# EAGLE design TwoMotorController 2.0 (EAGLE 6.6.0)
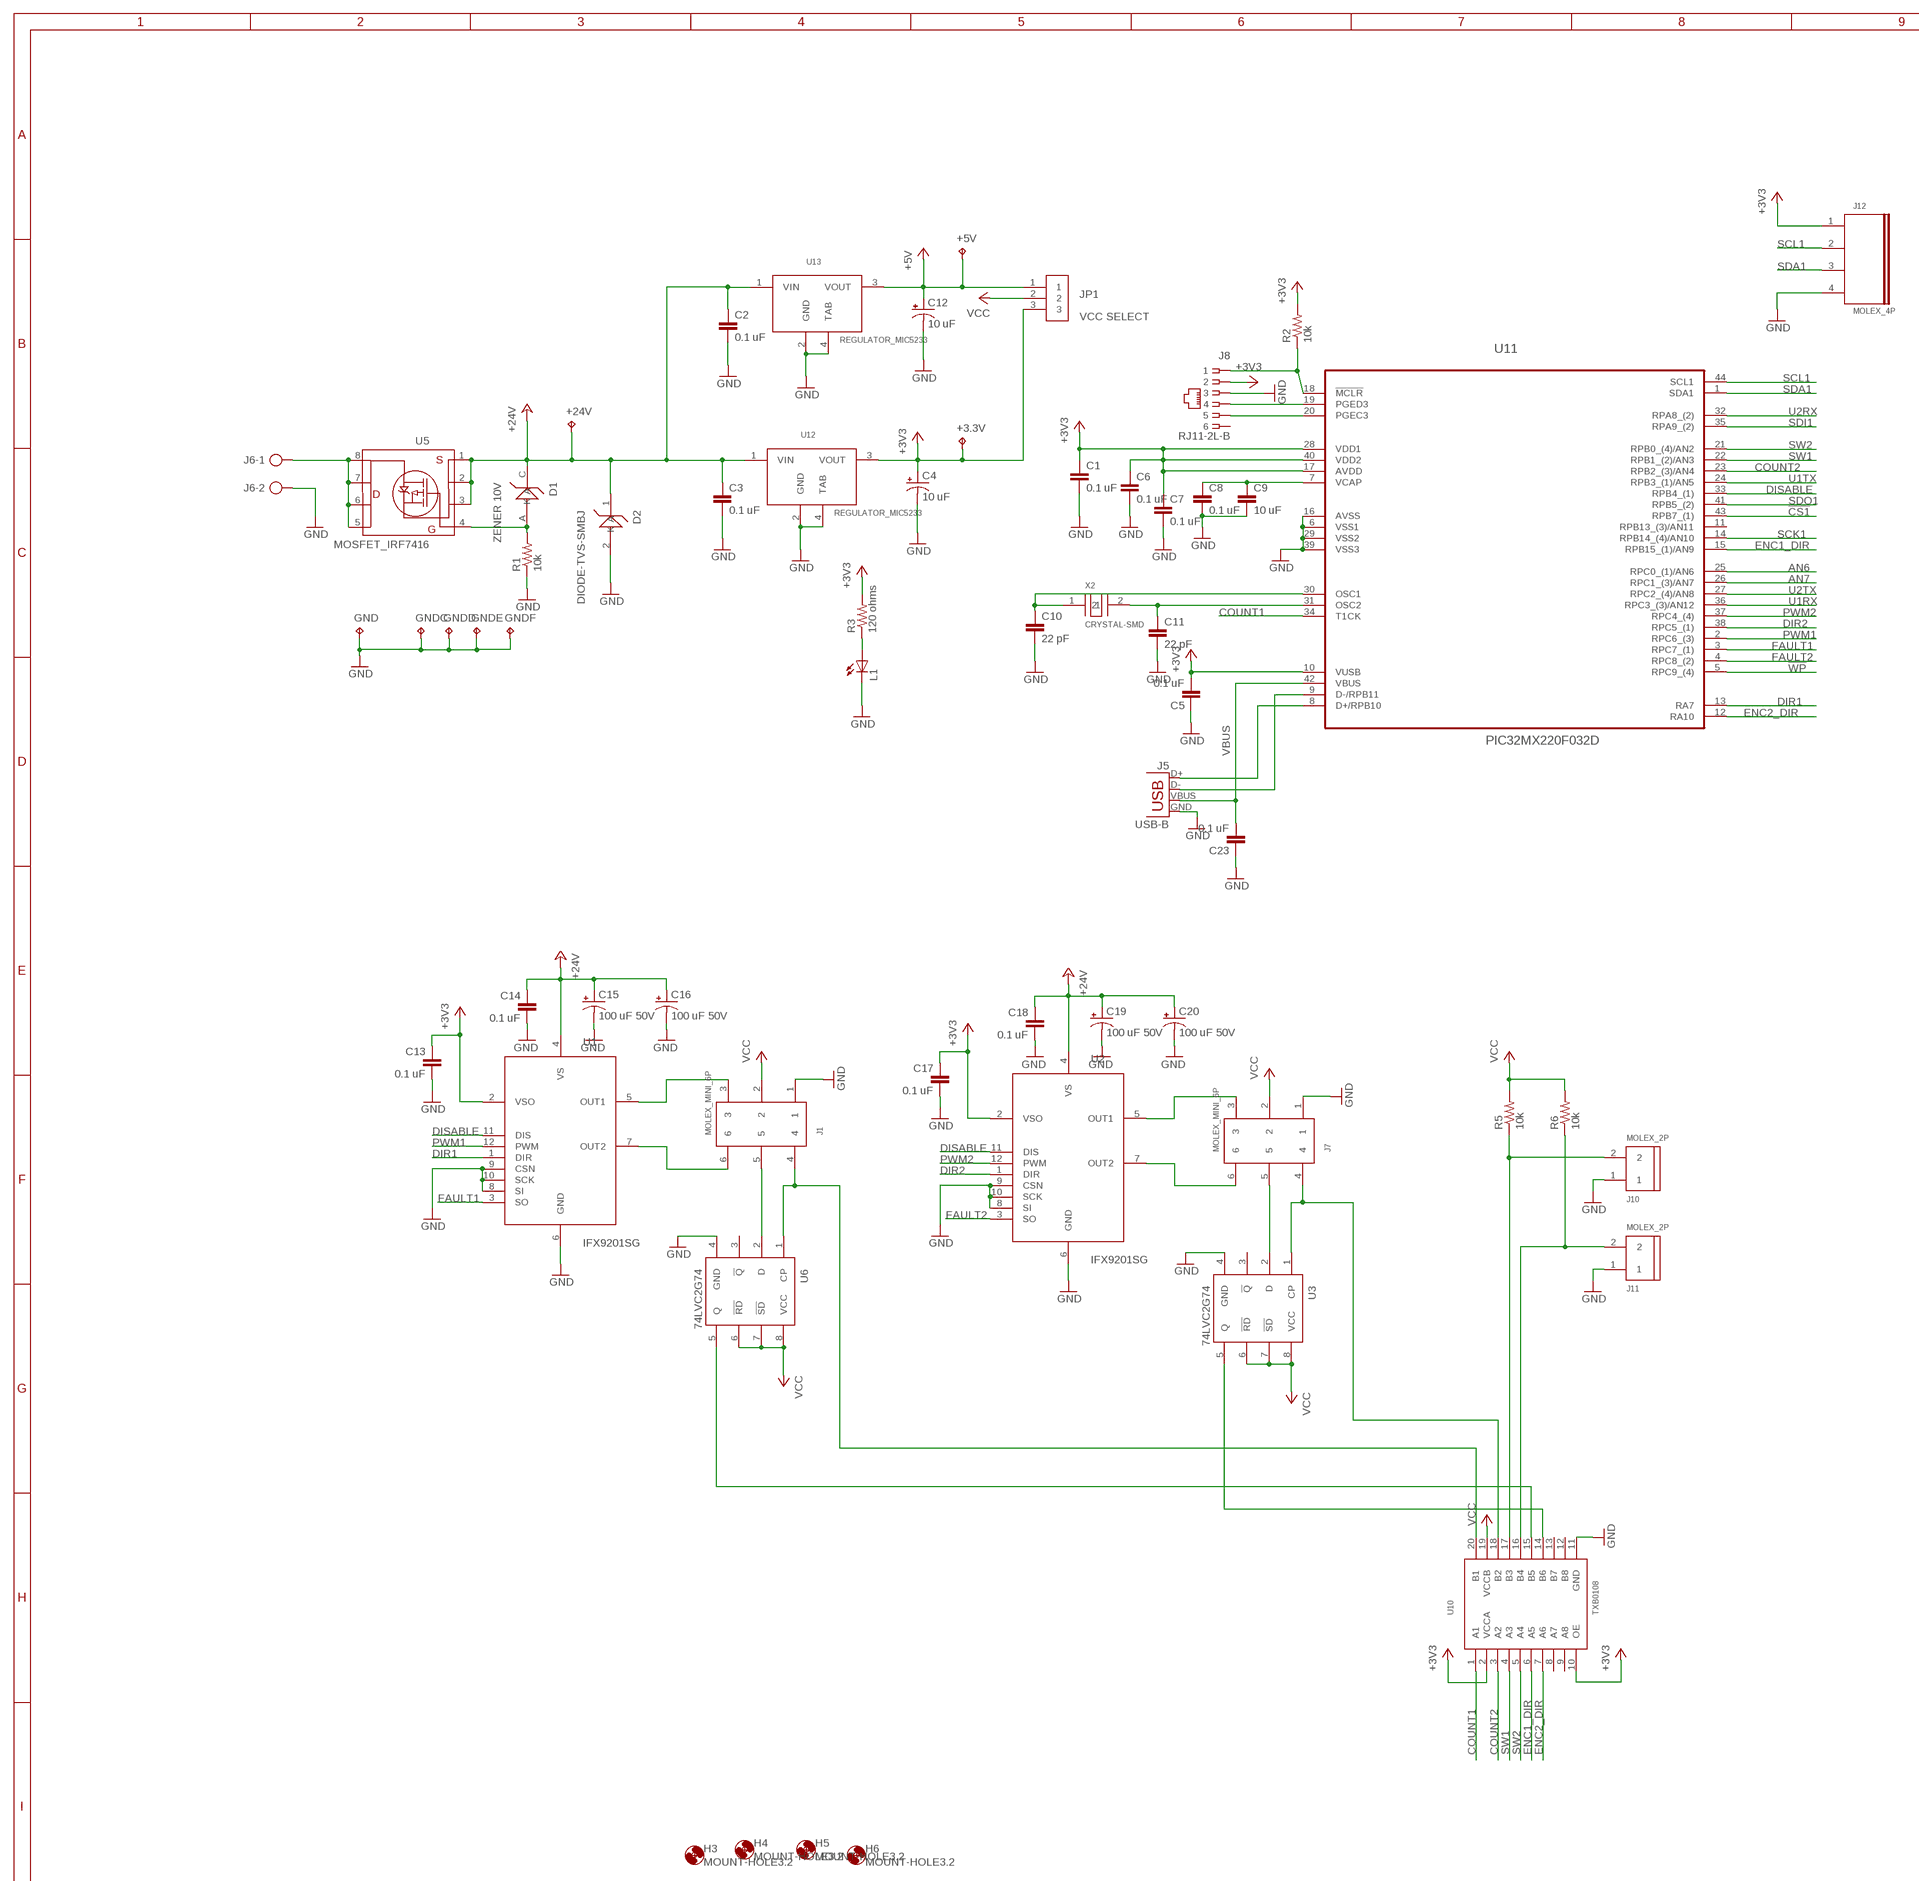
[diagram p0: schematic, sheet 1, part 1 of 2]
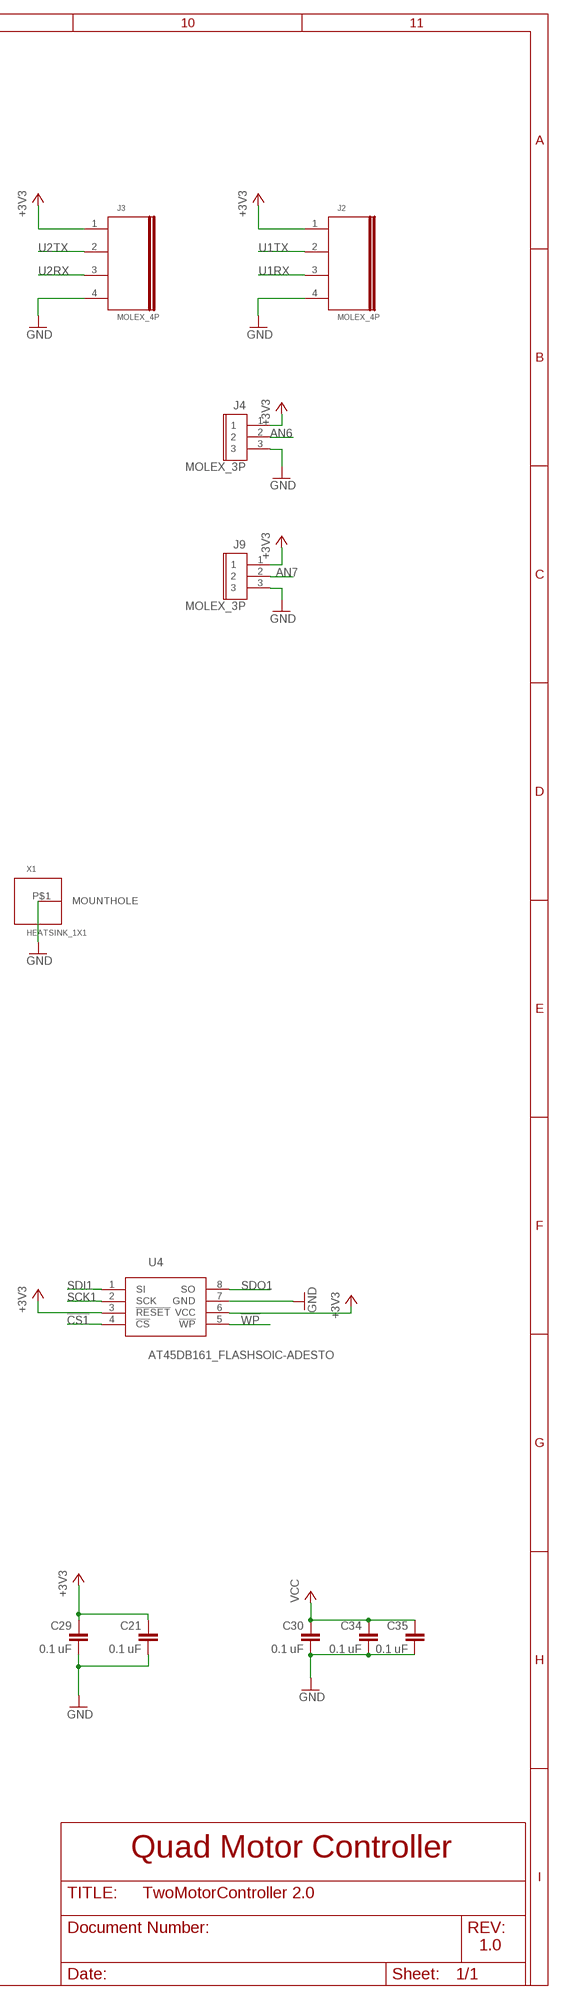
[diagram p1: schematic, sheet 1, part 2 of 2]

## Parts
+3.3V  TP  [TESTPAD]
+5V  TP  [TESTPAD]
+24V  TP  [TESTPAD]
C1  0.1 uF  C0805  [C0805]
C2  0.1 uF  C0805  [C0805]
C3  0.1 uF  C0805  [C0805]
C4  10 uF  POLCAPE2-5  [POLCAP_2MM]
C5  0.1 uF  C2,5-3  [C2.5-3]
C6  0.1 uF  C0805  [C0805]
C7  0.1 uF  C0805  [C0805]
C8  0.1 uF  C0805  [C0805]
C9  10 uF  C0805  [C0805]
C10  22 pF  C0805  [C0805]
C11  22 pF  C0805  [C0805]
C12  10 uF  POLCAPE2-5  [POLCAP_2MM]
C13  0.1 uF  C0805  [C0805]
C14  0.1 uF  C0805  [C0805]
C15  100 uF 50V  POLCAPE3.5-10  [E3,5-10]
C16  100 uF 50V  POLCAPE3.5-10  [E3,5-10]
C17  0.1 uF  C0805  [C0805]
C18  0.1 uF  C0805  [C0805]
C19  100 uF 50V  POLCAPE3.5-10  [E3,5-10]
C20  100 uF 50V  POLCAPE3.5-10  [E3,5-10]
C21  0.1 uF  C0805  [C0805]
C23  0.1 uF  C2,5-3  [C2.5-3]
C29  0.1 uF  C0805  [C0805]
C30  0.1 uF  C0805  [C0805]
C34  0.1 uF  C0805  [C0805]
C35  0.1 uF  C0805  [C0805]
D1  ZENER 10V  DIODE-ZENERDO-214AC  [DO-214AC]
D2  DIODE-TVS-SMBJ  [DIODE-TVS-SMBJ]
GND  TP  [TESTPAD]
GNDC  TP  [TESTPAD]
GNDD  TP  [TESTPAD]
GNDE  TP  [TESTPAD]
GNDF  TP  [TESTPAD]
H3  MOUNT-HOLE3.2  [3,2]
H4  MOUNT-HOLE3.2  [3,2]
H5  MOUNT-HOLE3.2  [3,2]
H6  MOUNT-HOLE3.2  [3,2]
J1  MOLEX_MINI_6P  [MOLEX_MINI_6P]
J2  MOLEX_4P  [MOLEX_4P]
J3  MOLEX_4P  [MOLEX_4P]
J4  MOLEX_3P  [MOLEX_3P]
J5  USB-B  USBPTH  [USB-B-PTH]
J6  TRMBLOCK_5MM_2P  [TRMBLOCK_5MM_2P]
J7  MOLEX_MINI_6P  [MOLEX_MINI_6P]
J8  RJ11-2L-B  [RJ11-NO_SHIELD]
J9  MOLEX_3P  [MOLEX_3P]
J10  MOLEX_2P  [MOLEX_2P]
J11  MOLEX_2P  [MOLEX_2P]
J12  MOLEX_4P  [MOLEX_4P]
JP1  VCC SELECT  JUMPER_3P  [JUMPER_3P]
L1  LED5MM  [LED5MM]
R1  10k  RESISTORR0805  [R0805]
R2  10k  RESISTORR0805  [R0805]
R3  120 ohms  RESISTORR0805  [R0805]
R5  10k  RESISTORR0805  [R0805]
R6  10k  RESISTORR0805  [R0805]
U1  IFX9201SG  [IFX9201SG]
U2  IFX9201SG  [IFX9201SG]
U3  74LVC2G74  [TSSOP8]
U4  AT45DB161_FLASHSOIC-ADESTO  [SOIC-ADESTO]
U5  MOSFET_IRF7416  [SO-8-3.9MM]
U6  74LVC2G74  [TSSOP8]
U10  TXB0108  [TSSOP20]
U11  PIC32MX220F032D  [QFP80P1200X1200X120-44N]
U12  REGULATOR_MIC5233  [REGULATOR_MIC5233]
U13  REGULATOR_MIC5233  [REGULATOR_MIC5233]
X1  HEATSINK_1X1  [HEATSINK_1X1]
X2  CRYSTAL-SMD  [CRYSTAL-SMD]

## Nets
!CS1: U4.4(!CS) U11.43(RPB7_(1))
!WP: U4.5(!WP) U11.5(RPC9_(4))
+3V3: +3.3V.P$1(TP) C1.1 C4.+ C5.2 C6.1 C7.1 C13.1 C17.1 C21.1 C29.1 J2.1 J3.1 J4.1 J8.2 J9.1 J12.1 JP1.3 R2.2 R3.2 U1.2(VSO) U2.2(VSO) U4.3(!RESET) U4.6(VCC) U10.2(VCCA) U10.10(OE) U11.10(VUSB) U11.17(AVDD) U11.28(VDD1) U11.40(VDD2) U12.3(VOUT)
+5V: +5V.P$1(TP) C12.+ JP1.1 U13.3(VOUT)
+24V: +24V.P$1(TP) C2.1 C3.1 C14.1 C15.+ C16.+ C18.1 C19.+ C20.+ D1.C(K) D2.1(K) U1.4(VS) U2.4(VS) U5.1 U5.2 U5.3 U12.1(VIN) U13.1(VIN)
AN6: J4.2 U11.25(RPC0_(1)/AN6)
AN7: J9.2 U11.26(RPC1_(3)/AN7)
COUNT1: U10.1(A1) U11.34(T1CK)
COUNT2: U10.3(A2) U11.23(RPB2_(3)/AN4)
DIR1: U1.1(DIR) U11.13(RA7)
DIR2: U2.1(DIR) U11.38(RPC5_(1))
DISABLE: U1.11(DIS) U2.11(DIS) U11.33(RPB4_(1))
ENC1_DIR: U10.6(A5) U11.15(RPB15_(1)/AN9)
ENC2_DIR: U10.7(A6) U11.12(RA10)
FAULT1: U1.3(SO) U11.3(RPC7_(1))
FAULT2: U2.3(SO) U11.4(RPC8_(2))
GND: C1.2 C2.2 C3.2 C4.- C5.1 C6.2 C7.2 C8.2 C9.2 C10.2 C11.2 C12.- C13.2 C14.2 C15.- C16.- C17.2 C18.2 C19.- C20.- C21.2 C23.1 C29.2 C30.2 C34.2 C35.2 D2.2(A) GND.P$1(TP) GNDC.P$1(TP) GNDD.P$1(TP) GNDE.P$1(TP) GNDF.P$1(TP) J1.1 J2.4 J3.4 J4.3 J5.GND J6.2 J7.1 J8.3 J9.3 J10.1 J11.1 J12.4 L1.K(C) R1.1 U1.6(GND) U1.8(SI) U1.9(CSN) U1.10(SCK) U2.6(GND) U2.8(SI) U2.9(CSN) U2.10(SCK) U3.4(GND) U4.7(GND) U6.4(GND) U10.11(GND) U11.6(VSS1) U11.16(AVSS) U11.29(VSS2) U11.39(VSS3) U12.2(GND) U12.4(TAB) U13.2(GND) U13.4(TAB) X1.P$1(MOUNTHOLE)
N$1: J7.3 U2.5(OUT1)
N$2: C11.1 U11.31(OSC2) X2.2
N$3: C10.1 U11.30(OSC1) X2.1
N$4: J1.3 U1.5(OUT1)
N$5: J6.1 U5.5 U5.6 U5.7 U5.8
N$6: D1.A R1.2 U5.4
N$7: J1.6 U1.7(OUT2)
N$8: J1.5 U6.2(D)
N$9: U6.5(Q) U10.15(B5)
N$10: J8.1 R2.1 U11.18(!MCLR)
N$11: J8.4 U11.19(PGED3)
N$12: J8.5 U11.20(PGEC3)
N$13: C8.1 C9.1 U11.7(VCAP)
N$14: J7.6 U2.7(OUT2)
N$15: J7.5 U3.2(D)
N$16: U3.5(Q) U10.14(B6)
N$17: J10.2 R5.1 U10.17(B3)
N$18: J11.2 R6.1 U10.16(B4)
N$22: J5.D+ U11.8(D+/RPB10)
N$23: J5.D- U11.9(D-/RPB11)
N$29: L1.A R3.1
N$30: J1.4 U6.1(CP) U10.20(B1)
N$31: J7.4 U3.1(CP) U10.18(B2)
PWM1: U1.12(PWM) U11.2(RPC6_(3))
PWM2: U2.12(PWM) U11.37(RPC4_(4))
SCK1: U4.2(SCK) U11.14(RPB14_(4)/AN10)
SCL1: J12.2 U11.44(SCL1)
SDA1: J12.3 U11.1(SDA1)
SDI1: U4.1(SI) U11.35(RPA9_(2))
SDO1: U4.8(SO) U11.41(RPB5_(2))
SW1: U10.4(A3) U11.22(RPB1_(2)/AN3)
SW2: U10.5(A4) U11.21(RPB0_(4)/AN2)
U1RX: J2.3 U11.36(RPC3_(3)/AN12)
U1TX: J2.2 U11.24(RPB3_(1)/AN5)
U2RX: J3.3 U11.32(RPA8_(2))
U2TX: J3.2 U11.27(RPC2_(4)/AN8)
VBUS: C23.2 J5.VBUS U11.42(VBUS)
VCC: C30.1 C34.1 C35.1 J1.2 J7.2 JP1.2 R5.2 R6.2 U3.6(!RD) U3.7(!SD) U3.8(VCC) U6.6(!RD) U6.7(!SD) U6.8(VCC) U10.19(VCCB)
Unconnected: J8.6 U3.3(!Q) U6.3(!Q) U10.8(A7) U10.9(A8) U10.12(B8) U10.13(B7) U11.11(RPB13_(3)/AN11)

## Notes on the sheet
- Quad Motor Controller
- 1.0

## Library data of the parts
+3.3V +5V +24V GND GNDC GNDD GNDE GNDF = JimLib:TP: Test pad
C1-C3 C6-C11 C13 C14 C17 C18 C21 C29 C30 C34 C35 = JimLib:C0805
C4 C12 C15 C16 C19 C20 = JimLib:POLCAP: POLARIZED CAPACITOR, American symbol
C5 C23 = JimLib:C: CAPACITOR naming: grid - package width
D1 = JimLib:DIODE-ZENER
D2 = JimLib:DIODE-TVS-SMBJ
H3-H6 = holes:MOUNT-HOLE: MOUNTING HOLE with drill center marker
J1 J7 = JimLib:MOLEX_MINI_6P
J2 J3 J12 = JimLib:MOLEX_4P: .100" (2.54mm) Center Header - 3 Pin
J4 J9 = JimLib:MOLEX_3P
J5 = SparkFun-Connectors:USB: USB Connectors USB-B-PTH is fully proven SKU : PRT-00139/CONN-08278 USB-miniB is fully proven SKU : PRT-00587 USB-A-PCB is untested. USB-A-H is throughly reviewed, but untested. Spark Fun Electronics SKU : PRT-00437 USB-B-SMT is throughly reviewed, but untested. Needs silkscreen touching up. USB-A-S has not been used/tested USB-MB-H has not been used/tested USB-MICROB has been used. CONN-09505; PROD_ID: CONN-08278
J6 = JimLib:TRMBLOCK_5MM_2P: CONNECTOR
J8 = JimLib:RJ11: CORCOM Modular RJ Jacks No Shield Source: www.tycoelectronics.com .. ENG_DS_1654001_1099_RJ_L_0507.pdf; MF: TYCO ELECTRONICS; MPN: RJ11-2L-B; OC_FARNELL: unknown; OC_NEWARK: 83F4463
J10 J11 = JimLib:MOLEX_2P
JP1 = JimLib:JUMPER_3P
L1 = led:LED: LED OSRAM: - CHIPLED LG R971, LG N971, LY N971, LG Q971, LY Q971, LO R971, LY R971 LH N974, LH R974 LS Q976, LO Q976, LY Q976 LO Q996 - Hyper CHIPLED LW Q18S LB Q993, LB Q99A, LB R99A - SideLED LS A670, LO A670, LY A670, LG A670, LP A670 LB A673, LV A673, LT A673, LW A673 LH A674 LY A675 LS A676, LA A676, LO A676, LY A676, LW A676 LS A679, LY A679, LG A679 - Hyper Micro SIDELED® LS Y876, LA Y876, LO Y876, LY Y876 LT Y87S - SmartLED LW L88C, LW L88S LB L89C, LB L89S, LG L890 LS L89K, LO L89K, LY L89K LS L896, LA L896, LO L896, LY L896 - TOPLED LS T670, LO T670, LY T670, LG T670, LP T670 LSG T670, LSP T670, LSY T670, LOP T670, LYG T670 LG T671, LOG T671, LSG T671 LB T673, LV T673, LT T673, LW T673 LH T674 LS T676, LA T676, LO T676, LY T676, LB T676, LH T676, LSB T676, LW T676 LB T67C, LV T67C, LT T67C, LS T67K, LO T67K, LY T67K, LW E67C LS E67B, LA E67B, LO E67B, LY E67B, LB E67C, LV E67C, LT E67C LW T67C LS T679, LY T679, LG T679 LS T770, LO T770, LY T770, LG T770, LP T770 LB T773, LV T773, LT T773, LW T773 LH T774 LS E675, LA E675, LY E675, LS T675 LS T776, LA T776, LO T776, LY T776, LB T776 LHGB T686 LT T68C, LB T68C - Hyper Mini TOPLED® LB M676 - Mini TOPLED Santana® LG M470 LS M47K, LO M47K, LY M47K Source: http://www.osram.convergy.de LUXEON: - LUMILED® LXK2-PW12-R00, LXK2-PW12-S00, LXK2-PW14-U00, LXK2-PW14-V00 LXK2-PM12-R00, LXK2-PM12-S00, LXK2-PM14-U00 LXK2-PE12-Q00, LXK2-PE12-R00, LXK2-PE12-S00, LXK2-PE14-T00, LXK2-PE14-U00 LXK2-PB12-K00, LXK2-PB12-L00, LXK2-PB12-M00, LXK2-PB14-N00, LXK2-PB14-P00, LXK2-PB14-Q00 LXK2-PR12-L00, LXK2-PR12-M00, LXK2-PR14-Q00, LXK2-PR14-R00 LXK2-PD12-Q00, LXK2-PD12-R00, LXK2-PD12-S00 LXK2-PH12-R00, LXK2-PH12-S00 LXK2-PL12-P00, LXK2-PL12-Q00, LXK2-PL12-R00 Source: www.luxeon.com KINGBRIGHT: KA-3528ASYC Source: www.kingbright.com
R1-R3 R5 R6 = JimLib:RESISTOR: RESISTOR, American symbol
U1 U2 = JimLib:IFX9201SG: Infineon 6A H Bridge
U3 U6 = JimLib:74LVC2G74
U4 = JimLib:AT45DB161_FLASH
U5 = JimLib:MOSFET_IRF7416: MOSFET P-CH 30V 10A 8-SOIC IRF7416TRPBFCT-ND
U10 = JimLib:TXB0108
U11 = JimLib:PIC32MX220F032D: PIC32MX220F032D-I/PT 44-TQFP; MPN: PIC18F4550-I/PT; OC_FARNELL: 9321365; OC_NEWARK: 08J9633; PACKAGE: QFP-44; SUPPLIER: Microchip
U12 U13 = JimLib:REGULATOR_MIC5233
X1 = JimLib:HEATSINK_1X1: Ohmite #E3A-T220-25E 1" x 1" heatsink with #8-32 mounting hole DigiKey #E3A-T220-25E-ND
X2 = JimLib:CRYSTAL-SMD

## Board
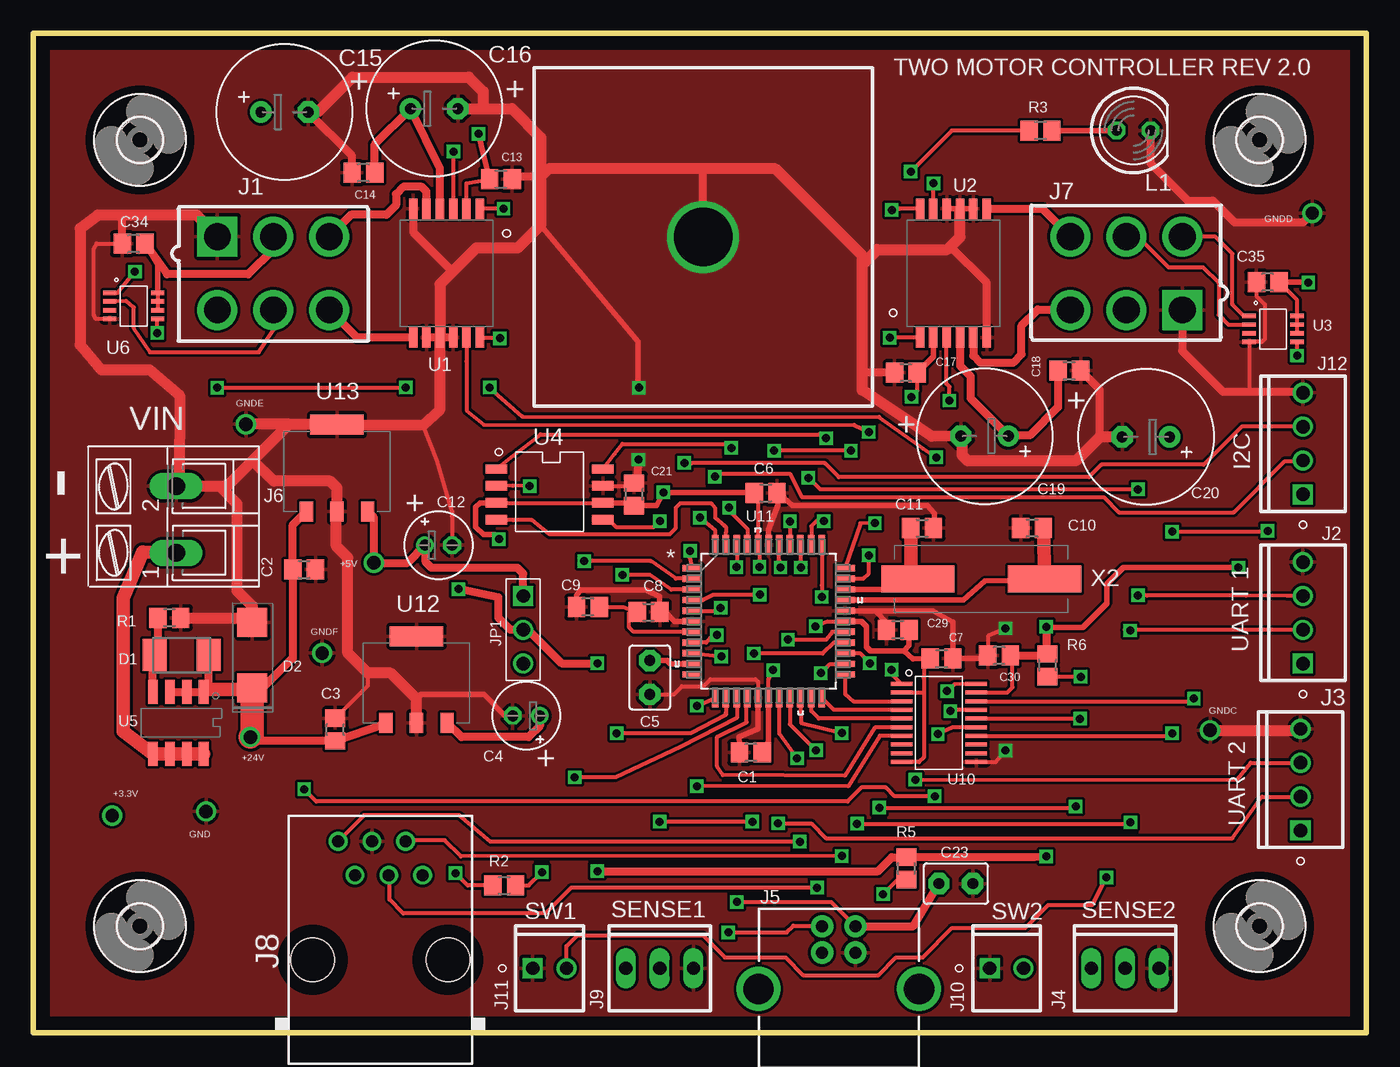
[diagram p2: board, top side]
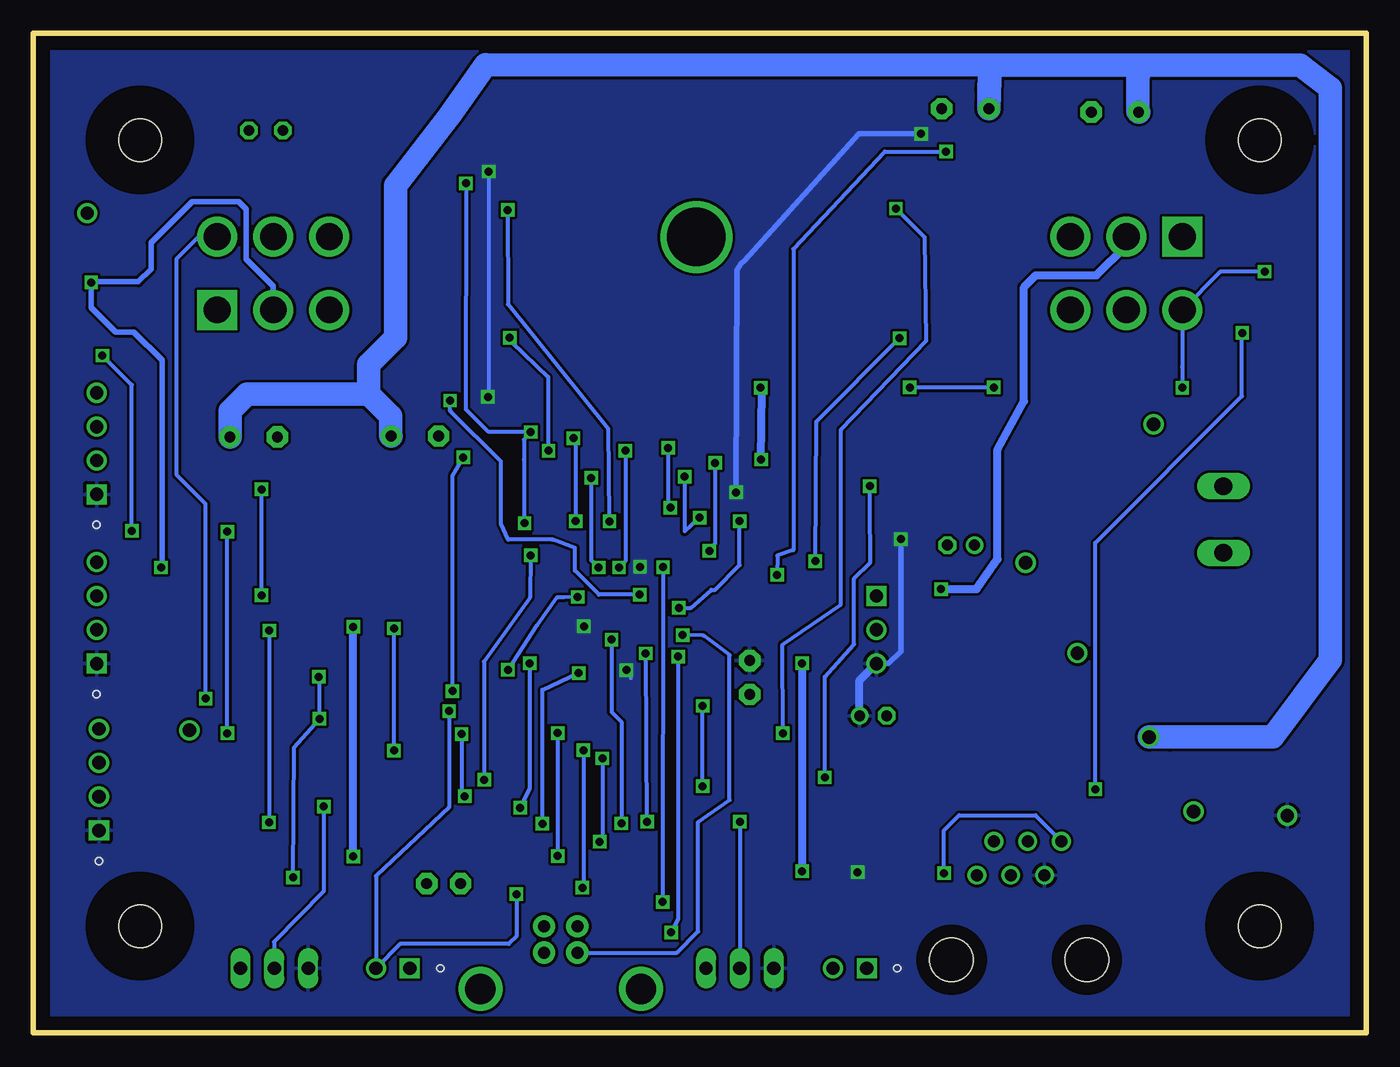
[diagram p3: board, bottom side, seen from below]

Size 100 x 75.03 mm. Coordinates in mm from the lower left corner, seen from the top.
Outline: 0,0.03 0,75.03 100,75.03 100,0.03 0,0.03
Copper layers (1*16): Top 0.035mm / dielectric 1.5mm / Bottom 0.035mm
Design rules "default *": minimum track width 10mil, minimum drill 22mil, track to track 8mil, track to pad 8mil, pad to pad 8mil, via to via 8mil, smd to smd 8mil, copper to edge 40mil, drill to drill 8mil, minimum pad ring 10mil, minimum via ring 8mil, stop-mask expansion 4mil, vias tented up to drill 0mil, thermal gap 10mil

### Footprints (pad centres in the part's own frame; a part is rotated, then mirrored left to right if it is on the bottom)
TESTPAD = drill 1: P$1 0,0
C0805 = smd 1.3 x 1.5: 1 -0.85,0; 2 0.85,0
POLCAP_2MM = drill 0.813 pad 1.27: + -1.016,0 | drill 0.813 pad 1.27 octagon: - 1.016,0
C2.5-3 = drill 0.813 pad 1.6 octagon: 1 -1.27,0; 2 1.27,0
E3,5-10 = drill 0.813 pad 1.6: + -1.778,0 | drill 0.813 pad 1.6 octagon: - 1.778,0
DO-214AC = smd 1.8 x 2.4: A 2.025,0; C -2.025,0
DIODE-TVS-SMBJ = smd 2.16 x 2.26: 1 -2.45,0; 2 2.45,0
3,2 = hole 3.2: 0,0
MOLEX_MINI_6P = drill 2 square: 1 -4.2,2.75 | drill 2: 2 0,2.75; 3 4.2,2.75; 4 -4.2,-2.75; 5 0,-2.75; 6 4.2,-2.75
MOLEX_4P = drill 1 square: 1 -3.81,0 | drill 1: 2 -1.27,0; 3 1.27,0; 4 3.81,0
MOLEX_3P = drill 1 long: 1 -2.54,0; 2 0,0; 3 2.54,0
USB-B-PTH = drill 0.914 pad 1.676: D+ 0,1.25; D- 1.981,1.25; GND 0,-1.25; VBUS 1.981,-1.25 | drill 2.286: S1 -2.718,-6.02; S2 -2.718,6.02
TRMBLOCK_5MM_2P = drill 1.321 long: 1 -1.854,-1.27; 2 3.15,-1.27
RJ11-NO_SHIELD = drill 0.9 pad 1.4: 1 -3.175,8.89; 2 -1.905,6.35; 3 -0.635,8.89; 4 0.635,6.35; 5 1.905,8.89; 6 3.175,6.35 | hole 3.251: -5.08,0; 5.08,0
MOLEX_2P = drill 1 square: 1 -1.27,0 | drill 1: 2 1.27,0
JUMPER_3P = drill 1 square: 1 -2.54,0 | drill 1: 2 0,0; 3 2.54,0
LED5MM = drill 0.813 octagon: A -1.27,0; K 1.27,0
R0805 = smd 1.3 x 1.5: 1 -0.85,0; 2 0.85,0
IFX9201SG = smd 0.635 x 1.524: 1 -2.5,-4.826; 2 -1.5,-4.826; 3 -0.5,-4.826; 4 0.5,-4.826; 5 1.5,-4.826; 6 2.5,-4.826; 7 2.5,4.826; 8 1.5,4.826; 9 0.5,4.826; 10 -0.5,4.826; 11 -1.5,4.826; 12 -2.5,4.826
TSSOP8 = smd 0.33 x 1: 1 -0.975,-1.8; 2 -0.325,-1.8; 3 0.325,-1.8; 4 0.975,-1.8; 5 0.975,1.8; 6 0.325,1.8; 7 -0.325,1.8; 8 -0.975,1.8
SOIC-ADESTO = smd 0.7 x 1.6: 1 -1.27,-4; 2 0,-4; 3 1.27,-4; 4 2.54,-4; 5 2.54,4; 6 1.27,4; 7 0,4; 8 -1.27,4
SO-8-3.9MM = smd 0.72 x 1.8: 1 -1.905,-2.34; 2 -0.635,-2.34; 3 0.635,-2.34; 4 1.905,-2.34; 5 1.905,2.34; 6 0.635,2.34; 7 -0.635,2.34; 8 -1.905,2.34
TSSOP20 = smd 0.3 x 1.6: 1 -2.925,-2.8; 2 -2.275,-2.8; 3 -1.625,-2.8; 4 -0.975,-2.8; 5 -0.325,-2.8; 6 0.325,-2.8; 7 0.975,-2.8; 8 1.625,-2.8; 9 2.275,-2.8; 10 2.925,-2.8; 11 2.925,2.8; 12 2.275,2.8; 13 1.625,2.8; 14 0.975,2.8; 15 0.325,2.8; 16 -0.325,2.8; 17 -0.975,2.8; 18 -1.625,2.8; 19 -2.275,2.8; 20 -2.925,2.8
QFP80P1200X1200X120-44N = smd 1.473 x 0.483: 1 -5.74,3.988; 2 -5.74,3.2; 3 -5.74,2.388; 4 -5.74,1.6; 5 -5.74,0.787; 6 -5.74,0; 7 -5.74,-0.787; 8 -5.74,-1.6; 9 -5.74,-2.388; 10 -5.74,-3.2; 11 -5.74,-3.988; 23 5.74,-3.988; 24 5.74,-3.2; 25 5.74,-2.388; 26 5.74,-1.6; 27 5.74,-0.787; 28 5.74,0; 29 5.74,0.787; 30 5.74,1.6; 31 5.74,2.388; 32 5.74,3.2; 33 5.74,3.988 | smd 0.483 x 1.473: 12 -3.988,-5.74; 13 -3.2,-5.74; 14 -2.388,-5.74; 15 -1.6,-5.74; 16 -0.787,-5.74; 17 0,-5.74; 18 0.787,-5.74; 19 1.6,-5.74; 20 2.388,-5.74; 21 3.2,-5.74; 22 3.988,-5.74; 34 3.988,5.74; 35 3.2,5.74; 36 2.388,5.74; 37 1.6,5.74; 38 0.787,5.74; 39 0,5.74; 40 -0.787,5.74; 41 -1.6,5.74; 42 -2.388,5.74; 43 -3.2,5.74; 44 -3.988,5.74
REGULATOR_MIC5233 = smd 1 x 1.5: 1 -2.3,0; 2 0,0; 3 2.3,0 | smd 4 x 1.5: 4 0,6.5
HEATSINK_1X1 = drill 4.394: P$1 0,0
CRYSTAL-SMD = smd 5.5 x 2: 1 -4.75,0; 2 4.75,0

### Placement (x,y rotation side)
+3.3V  5.92,16.33 0 top
+5V  25.55,35.3 0 top
+24V  16.28,22.22 0 top
C1  53.83,21.07 180 top
C2  20.32,34.8 0 top
C3  22.65,22.78 90 top
C4  36.99,23.82 180 top
C5  46.25,26.69 90 top
C6  54.94,40.53 0 top
C7  68.14,28.11 0 top
C8  46.15,31.59 0 top
C9  41.61,31.98 180 top
C10  74.93,37.9 180 top
C11  66.67,37.9 0 top
C12  30.4,36.62 0 top
C13  35.08,64.08 0 top
C14  24.77,64.56 180 top
C15  18.85,69.12 0 top
C16  30.07,69.38 0 top
C17  65.47,49.56 180 top
C18  77.72,49.72 0 top
C19  71.38,44.81 180 top
C20  83.47,44.75 180 top
C21  45.09,40.44 90 top
C23  69.22,11.23 180 top
C29  64.85,30.27 180 top
C30  72.46,28.34 180 top
C34  7.53,59.25 180 top
C35  92.61,56.36 180 top
D1  11.13,28.37 180 top
D2  16.43,28.37 90 top
GND  12.95,16.64 0 top
GNDC  88.29,22.73 0 top
GNDD  95.96,61.54 0 top
GNDE  15.95,45.69 0 top
GNDF  21.67,28.52 0 top
H3  8,8.03 0 top
H4  92,8.03 0 top
H5  8,67.03 0 top
H6  92,67.03 0 top
J1  18,57.03 0 top
J2  95.25,31.55 90 top
J3  95.07,19.02 90 top
J4  81.92,4.88 0 top
J5  60.43,6.04 90 top
J6  9.45,37.9 90 top
J7  82,57.03 180 top
J8  26.04,5.51 0 top
J9  46.99,4.88 0 top
J10  73.03,4.88 0 top
J11  38.73,4.88 0 top
J12  95.25,44.25 90 top
JP1  36.75,30.27 270 top
L1  82.55,67.74 0 top
R1  10.21,31.16 180 top
R2  35.33,11.1 0 top
R3  75.56,67.74 180 top
R5  65.51,12.37 90 top
R6  76.1,27.61 90 top
U1  31,57.03 180 top
U2  69.03,57.03 0 top
U3  93.02,52.85 270 top
U4  38.73,41.07 270 top
U5  10.88,23.29 180 top
U6  7.53,54.58 270 top
U10  67.94,23.29 270 top
U11  55.16,30.91 0 top
U12  28.75,23.29 0 top
U13  22.78,39.17 0 top
X1  50.25,59.75 0 top
X2  71.12,34.09 180 top

### Tracks (layer width: path | path; a pad name or v marks a point on that pad's centre or on a via)
!CS1
  Top 0.305: U11.43 51.97,37.57 51.97,38 51.84,38.1 51.16,38.68 51.16,39.39 50.83,39.78 48.54,39.78 48.21,39.44 48.21,37.92 47.73,37.44 38.73,37.44 37.41,38.51 36.03,38.51 U4.4
!WP  (via drill 0.6)
  Top 0.305: U11.5 51.33,31.7 v51.56,31.93 | 46.97,38.33 v47.02,38.43 46.58,38 43.71,38 43.18,38.53 U4.5
  Bottom 0.305: v51.56,31.93 50.65,31.93 49.12,33.27 48.87,33.27 47.02,35.13 v47.02,38.43
+3V3  (via drill 0.6)
  Top 0.305: U1.2 32.5,63.78 C13.1 | U4.3 U4.6 | C7.1 66.81,27.7 66.8,26.64 66.8,25.58 | 66.8,25.58 66.8,20.7 66.45,20.34 65.17,20.34 U10.10 | U10.2 66.79,25.56 66.8,25.58 | R3.2 68.91,67.74 v65.84,64.67 | v65.89,47.75 65.89,47.78 66.32,48.21 C17.1 | 54.38,40.25 C6.1 54.38,40.53 54.38,37.82 U11.40 54.48,36.65 v54.48,35 | R2.2 37.16,11.1 v38.15,12.09 | v58.7,30.53 59.61,30.88 60.88,30.88 U11.28 | U11.17 55.16,26.56 v55.5,27.25
  Top 0.406: v33.4,67.49 33.72,66.19 C13.1 | U2.2 67.53,50.76 C17.1 | C6.1 53.51,40.59 v47.27,40.59 46.75,39.61 C21.1 44.87,39.8 U4.6 | U11.28 62.13,30.91 62.51,30.53 62.51,28.98 62.79,28.7 65.3,28.7 | 65.3,28.7 65.71,29.11 C29.1 | C7.1 65.99,28.09 65.3,28.7 | U11.17 55.16,21.91 C1.1 | U4.3 33.5,39.8 33.2,39.5 33.2,38 33.78,37.41 34.59,37.41 v34.92,37.08 | C5.2 47.55,27.96 47.8,27.71 U11.10
  Top 0.61: C4.+ 38,23.06 37.16,22.22 32.12,22.22 U12.3
  Bottom 0.305: v65.84,64.67 65.84,47.8 v65.89,47.75 | v38.15,12.09 38.15,12.14 | v55.5,27.25 55.17,26.64 | v54.48,35 54.13,35
  Bottom 0.406: v47.27,40.59 47.22,57.25 46.91,57.73 46.66,57.99 38.08,67.49 v33.4,67.49 | v34.92,37.08 34.92,28.65 35.84,27.73 JP1.3
  Bottom 0.61: C4.+ 38,26.48 JP1.3
  pour Bottom: 0.64,74.09 99.06,74.09 99.06,1.07 0.64,1.07
+5V
  Top 0.61: U13.3 25.55,38.69 +5V.P$1 28.06,35.3 C12.+ 29.44,36.57 29.44,35.36 29.87,34.92 36.32,34.92 36.75,34.5 JP1.1
+24V
  Top 0.61: U5.3 U5.2 U5.1 13.16,25.81 D1.C | U12.1 26.36,23.2 C3.1 16.57,21.93 +24V.P$1 | U2.4 69.53,50.08 70.31,49.3 70.31,47.66 C19.+ 73.2,44.86 74.75,44.86 76.88,46.98 C18.1 | C14.1 25.61,66.69 C16.+ 30.5,64.89 U1.4 | U13.1 19.47,38.16 C2.1 19.47,28.16 17.07,25.75 16.6,25.75 D2.1
  Top 1.016: 13.16,25.81 16.32,25.81 D2.1
  Top 1.778: D2.1 16.43,22.37 +24V.P$1
  Bottom 1.778: C15.+ 17.14,69.19 17.14,71.63 16.99,72.64 | C20.+ 85.25,46.68 83.97,47.95 74.83,47.95 | 74.83,47.95 73.18,46.3 73.18,44.83 C19.+ | 74.83,47.95 74.83,50.19 72.82,52.2 72.82,63.6 68.76,68.86 66.06,72.67 28.25,72.64 28.32,70.86 28.32,69.4 C16.+ 28.21,72.65 23.37,72.64 16.99,72.64 | 16.99,72.64 4.95,72.64 2.69,70.92 2.69,28.01 7.01,22.25 14.71,22.22 +24V.P$1
AN6  (via drill 0.6)
  Top 0.305: U11.25 62,28.52 v62.76,27.76 | v63.48,16.91 77.85,16.91 v78.21,17.02
  Bottom 0.305: v62.76,27.76 62.76,18.39 v63.48,16.91 | v78.21,17.02 78.21,10.67 81.94,6.86 81.97,4.93 J4.2
AN7  (via drill 0.6)
  Top 0.305: U11.26 60.07,29.31 59.21,28.5 v54.05,28.5 | v53.95,15.87 v46.99,15.87
  Bottom 0.305: v54.05,28.5 54,15.59 v53.95,15.87 | v46.99,15.87 J9.2
COUNT1  (via drill 0.6)
  Top 0.305: U11.34 59.15,33.63 v59.16,32.74 | v64.39,27.28 64.39,26.97 U10.1
  Bottom 0.305: v59.16,32.74 60.2,32.71 60.73,32.69 62.2,30.63 v64.39,27.28
COUNT2
  Top 0.305: U11.23 60.91,25.45 61.52,24.92 U10.3
DIR1  (via drill 0.6)
  Top 0.305: U11.13 51.97,24.05 51.97,23.9 49.3,22.5 v43.76,22.5 | v35.28,61.87 33.52,61.87 U1.1
  Bottom 0.305: v43.76,22.5 43.79,29.16 39.42,32.18 39.4,45.29 32.99,51.97 33.12,59.71 v35.28,61.87
DIR2  (via drill 0.6)
  Top 0.305: U2.1 65.39,52.2 v64.26,52.2 | v61.34,43.71 v55.58,43.71 | v56.06,34.95 56.06,35.36 55.93,35.48 55.93,36.63 U11.38
  Bottom 0.305: v64.26,52.2 64.14,51.86 61.37,49.25 61.37,43.74 v61.34,43.71 | v55.58,43.71 55.58,35.43 v56.06,34.95
DISABLE  (via drill 0.6)
  Top 0.305: U2.11 67.53,63.53 v67.54,63.78 | v63.14,38.28 62.05,38.25 U11.33 | U1.11 32.5,50.41 32.51,49.3 32.51,46.73 33.81,45.67 61.57,45.64 v62.69,45.11
  Bottom 0.305: v67.54,63.78 67.56,46.89 67.56,46.84 65.89,45.16 62.74,45.16 v62.69,45.11 63.07,44.73 63.18,44.51 63.2,43.03 63.2,38.25 v63.14,38.28
ENC1_DIR
  Top 0.305: U10.6 63.15,22.94 60.88,19.33 51.74,19.38 51.31,20.01 51.31,22.25 53.52,23.34 53.52,25.12 U11.15
ENC2_DIR  (via drill 0.6)
  Top 0.305: U10.7 63.52,22.31 61.14,18.54 50.09,18.57 v49.78,18.54 | v49.78,24.56 U11.12
  Bottom 0.305: v49.78,18.54 v49.78,24.56
FAULT1  (via drill 0.6)
  Top 0.305: U11.3 47.85,33.3 46.25,34.39 v44.2,34.39 | U1.3 31.52,61.88 v31.52,66.17
  Bottom 0.305: v31.52,66.17 36.12,66.17 42.98,58.85 42.98,36.24 44.17,35.84 v44.2,34.39
FAULT2  (via drill 0.6)
  Top 0.305: U11.4 50.22,32.51 51.03,32.92 v54.51,32.92 | v68.73,47.47 68.73,48.51 68.5,48.74 68.5,52.18 U2.3
  Bottom 0.305: v54.51,32.92 57.56,32.92 59.36,34.72 59.36,36.42 61.06,37.03 64.36,37.03 64.92,38.2 64.92,42.9 68.68,46.66 68.73,46.73 v68.73,47.47
GND  (via drill 0.6)
  Top 0.305: U4.7 45,41.05 C21.2 | 55.88,40.82 55.88,39.99 C6.2 | 91.39,48.13 91.22,48.3 U3.4 91.23,51.89 92.2,51.89 92.41,52.09 92.41,54.68 91.77,55.33 C35.2 | 7.31,61.09 7.01,61.39 | U10.11 72.22,20.35 v72.95,21.21 | v72.95,30.38 71.63,29.8 C30.2 | 25.09,27.02 25.09,26.07 C3.2 | 29.26,45.64 30.28,42.97 31.42,39.17 31.42,38.81 C12.- | 54.36,25.19 U11.16 54.38,26.36 54.18,26.57 50.8,26.57 50.27,26.03 48.67,26.03 48.06,25.42 C5.1 | U6.4 4.69,53.61 4.55,53.92 4.55,58.88 4.75,59.26 6.66,59.26 C34.2
  Top 0.406: C4.- 35.41,23.82 33.81,25.42 29.1,25.42 28.75,25.07 | 55.88,40.82 55.88,39.62 55.14,37.74 55.14,36.67 U11.39 | U11.6 48.11,30.91 47.42,31.59 C8.2 46.97,31.28 46.97,32.76 45.97,33.25 41.05,33.25 40.75,32.85 40.72,31.98 | 38.08,60.65 45.38,51.9 45.38,48.5 v45.44,48.44 | U2.10 U2.9 U2.8 | C29.2 64,30.84 63.17,31.67 | 63.17,31.67 63.14,31.7 U11.29 | 63.17,31.67 63.2,31.7 67.49,31.7 68.99,30.85 C7.2 71.56,28.11 C30.2 | 56.1,40.21 56.29,40.21 56.95,39.6 67.08,39.6 67.61,39.01 67.61,37.98 C11.2 | U11.16 54.37,25.11 54.37,22.84 52.96,22.22 52.98,21.71 C1.2
  Top 0.61: U1.10 U1.9 U1.8 | J7.1 86.2,51.19 89.26,48.13 91.39,48.13 95.17,48.13 J12.4 | C9.2 40.72,31.98 | U1.6 28.5,60.12 31.46,57.16 | C14.2 23.91,65.83 C15.- | 80,44.75 80,48.29 C18.2 | C17.2 62.33,49.56 62.2,49.43 | X1.P$1 50.25,64.83 50.22,64.87 | U2.6 71.53,56.31 68.81,59.03 | 38.08,64.29 36.05,64.29 C13.2 | L1.K 83.82,65.28 86.61,62.48 88.49,62.48 90.12,60.86 95.28,60.86 GNDD.P$1 | 45,41.05 45.38,41.79 v45.39,43.05 | C34.2 6.67,61.06 6.35,61.39
  Top 0.813: 13.97,41.05 J6.2 10.95,41.28 10.97,47.85 8.71,49.78 5.11,49.78 3.5,51.66 3.5,60.37 4.85,61.39 6.35,61.39 7.01,61.39 12.24,61.39 13.8,59.83 J1.1 | 13.97,41.05 14.53,41.05 16.47,42.99 | 16.47,42.99 19.18,45.69 | 19.18,45.69 22.75,45.69 U13.4 29.26,45.64 30.5,46.81 U1.9 30.5,56.21 31.46,57.16 33.22,58.93 36.35,58.93 38.08,60.65 38.08,64.29 | C16.- 33.93,69.38 | 33.93,69.38 35.91,69.38 38.08,67.21 38.08,64.29 | C15.- 21.32,69.12 23.95,71.75 32.66,71.75 33.76,70.66 33.76,69.55 33.93,69.38 | 62.2,57.68 62.2,49.43 62.2,48.26 67.41,44.78 C19.- 69.7,44.71 69.7,43.36 70.1,42.95 78.21,42.95 80,44.75 C20.- | 62.2,57.68 63.32,58.8 68.58,58.8 68.81,59.03 69.52,59.74 U2.9 | 62.2,57.68 62.2,58.34 55.68,64.87 50.22,64.87 38.66,64.87 38.08,64.29 | U12.2 28.75,25.07 26.8,27.02 25.09,27.02 23.6,28.52 23.6,35.69 22.73,36.55 22.73,39.12 U13.2 22.78,40.92 22.28,41.43 18.03,41.43 16.47,42.99 | R1.1 16.09,31.16 D2.2 16.43,32.06 15.29,33.2 15.29,39.72 13.97,41.05 | 56.1,40.21 C6.2 | GNDC.P$1 94.97,22.73 J3.4 | 19.18,45.69 GNDE.P$1
  Bottom 0.305: v72.95,21.21 v72.95,30.38
  Bottom 0.61: v45.39,43.05 45.34,48.18 v45.44,48.44
  pour Top: 0.64,74.09 99.06,74.09 99.06,1.07 0.64,1.07
N$1
  Top 0.61: U2.5 70.53,50.83 71.02,50.34 73.56,50.34 74.14,50.92 74.14,53.08 75.36,54.3 77.78,54.3 J7.3
N$2
  Top 0.406: U11.31 65.73,33.3 X2.2
  Top 1.016: C11.1 65.83,34.18 X2.2
N$3
  Top 0.406: U11.30 69.77,32.51 71.4,33.93 75.11,33.96 X2.1
  Top 1.016: X2.1 75.82,37.75 C10.1
N$4
  Top 0.61: U1.5 29.5,63.16 29.13,63.52 27.76,63.52 27.2,62.97 27.2,62.13 26.49,61.42 23.84,61.42 J1.3
N$5
  Top 1.016: J6.1 8.2,36.12 6.76,32.66 6.76,22.63 U5.5 U5.6 U5.7 U5.8
N$6
  Top 0.61: R1.2 9.31,28.6 D1.A 8.99,28.67 U5.4
N$7
  Top 0.61: U1.7 24.28,52.2 J1.6
N$8
  Top 0.305: J1.5 18,52.77 16.92,51.1 8.76,51.1 7.54,52.91 7.54,54.46 6.96,54.94 U6.2
N$9  (via drill 0.6)
  Top 0.305: U10.15 68.97,22.97 v67.87,22.45 | v67.64,17.78 64.62,17.78 63.96,18.44 62.13,18.44 61.09,17.4 21.23,17.4 v20.32,18.31 | v9.3,52.55 9.3,53.58 U6.5
  Bottom 0.305: v67.87,22.45 67.87,17.93 v67.64,17.78 | v20.32,18.31 20.32,36.8 9.32,47.8 9.32,52.53 v9.3,52.55
N$10  (via drill 0.6)
  Top 0.305: U11.18 55.95,22.48 v57.3,20.62 | v57.51,14.38 34.29,14.38 31.95,16.36 24.82,16.36 J8.1 | R2.1 32.59,11.1 v31.67,12.01
  Bottom 0.305: v57.3,20.62 57.3,14.38 v57.51,14.38 | v31.67,12.01 31.67,15.24 30.56,16.36 24.82,16.36 J8.1
N$11  (via drill 0.6)
  Top 0.305: U11.19 56.77,23.19 v58.73,21.23 | v58.8,10.92 40.36,10.92 38.43,8.99 27.76,8.99 26.72,10.03 26.72,11.81 J8.4
  Bottom 0.305: v58.73,21.23 58.73,11 v58.8,10.92
N$12  (via drill 0.6)
  Top 0.305: U11.20 57.6,23.29 v60.66,22.53 | v60.66,13.31 32.08,13.26 30.86,14.48 28.02,14.48 J8.5
  Bottom 0.305: v60.66,22.53 v60.66,13.31
N$13
  Top 0.305: U11.7 45.03,30.12 44.7,30.45 44.7,31.56 C8.1 44.28,31.98 C9.1
N$14
  Top 0.61: U2.7 75.72,61.86 J7.6
N$15
  Top 0.305: J7.5 82.86,59.78 85.17,57.48 87.76,57.48 88.92,56.31 88.92,53.92 89.66,53.16 U3.2
N$16  (via drill 0.6)
  Top 0.305: U10.14 85.26,22.31 v85.45,22.5 | v85.45,37.64 92.51,37.64 v92.61,37.69 | v94.82,50.85 U3.5
  Bottom 0.305: v85.45,22.5 v85.45,37.64 85.39,37.54 | v92.61,37.69 92.61,48.64 v94.82,50.85
N$17  (via drill 0.6)
  Top 0.305: U10.17 69.07,24.27 v68.81,24.18 | R5.1 64.83,11.52 v63.75,10.44
  Bottom 0.305: v68.81,24.18 68.81,16.97 74.3,11.81 J10.2 72.47,6.7 64.34,6.7 63.75,7.29 v63.75,10.44
N$18  (via drill 0.6)
  Top 0.305: U10.16 78.52,23.62 v78.54,23.59 | v78.59,26.74 76.11,26.74 R6.1 | J11.2 40.01,6.53 40.82,7.34 50.24,7.34 51.89,5.69 56.44,5.69 57.76,4.37 63.4,4.37 64.72,5.69 66.73,5.69 68.94,7.9 74.42,7.9 76.15,9.62 79.45,9.62 v80.52,11.68
  Bottom 0.305: v78.59,26.74 78.54,26.69 v78.54,23.59 80.42,21.46 v80.52,11.68
N$22  (via drill 0.6)
  Top 0.305: v51.28,29.87 50.98,29.87 50.47,29.31 U11.8
  Bottom 0.305: J5.D+ 51.71,6.04 50.11,7.64 50.11,15.85 47.75,17.5 47.75,28.37 49.73,29.84 v51.28,29.87
N$23  (via drill 0.6)
  Top 0.305: U11.9 v51.61,28.27 | v52.15,7.57 56.52,7.57 57.02,8.08 59.13,8.08 J5.D-
  Bottom 0.305: v51.61,28.27 51.61,8.56 v52.15,7.57
N$29
  Top 0.406: R3.1 L1.A
N$30  (via drill 0.6)
  Top 0.305: U10.20 69.11,26.19 v68.56,25.68 | v13.79,48.44 27.94,48.44 v27.94,48.46 | v34.24,48.46 34.19,48.46 36.68,46.28 63.45,46.25 66.78,43.86 67.59,43.31 v67.74,43.2 | U6.1 6.33,55.56 v7.62,57.15
  Bottom 0.305: v68.56,25.68 68.56,41.83 v67.74,43.2 | v13.79,48.44 13.8,50 J1.4 10.93,57.15 v7.62,57.15 | v27.94,48.46 v34.24,48.46
N$31  (via drill 0.6)
  Top 0.305: U3.1 90.83,53.83 89.97,54.68 89.97,58.49 88.7,59.76 86.22,59.76 J7.4 | U10.18 86.87,24.91 v87.07,25.12
  Bottom 0.305: v87.07,25.12 87.07,39.72 89.23,41.88 89.23,58.14 87.61,59.76 86.22,59.76 J7.4
PWM1  (via drill 0.6)
  Top 0.305: U11.2 48.21,34.11 46.33,35.43 v41.33,35.43 | v35,52.14 33.56,52.14 U1.12
  Bottom 0.305: v41.33,35.43 41.25,45.9 v35,52.14
PWM2  (via drill 0.6)
  Top 0.305: U2.12 64.98,61.86 v64.41,61.77 | v56.77,38.4 U11.37
  Bottom 0.305: v64.41,61.77 64.39,54.71 56.87,45.36 56.82,38.58 v56.77,38.4
SCK1  (via drill 0.6)
  Top 0.305: U11.14 52.78,23.67 48.56,21.49 43.66,19.2 v40.62,19.2 | v37.24,41.05 35.98,41.09 U4.2
  Bottom 0.305: v40.62,19.2 40.62,26.74 38.43,29.18 38.43,34.11 37.21,35.33 37.24,39.57 v37.24,41.05
SCL1  (via drill 0.6)
  Top 0.305: v51.13,41.76 51.44,41.96 56.79,41.96 57.68,40.23 80.31,40.23 81.46,39.09 90.07,39.09 93.9,42.92 95.2,42.92 J12.2 | v50.01,38.68 51.13,37.77 U11.44
  Bottom 0.305: v51.13,41.76 51.13,37.67 v50.01,38.68
SDA1  (via drill 0.6)
  Top 0.305: J12.3 90.65,45.52 87.81,42.67 80.14,42.67 79.2,41.73 60.43,41.73 59.38,42.77 49.35,42.77 v48.84,42.8 | v49.28,36.19 49.23,35.73 U11.1
  Bottom 0.305: v48.84,42.8 48.84,36.78 v49.28,36.19
SDI1  (via drill 0.6)
  Top 0.305: U4.1 36.01,43.34 38.05,44.93 58.95,44.93 v59.49,44.65 | 58.32,36.7 U11.35 58.37,38.05 58.75,38.43 v59.31,38.43
  Bottom 0.305: v59.49,44.65 59.31,44.47 v59.31,38.43
SDO1  (via drill 0.6)
  Top 0.305: U4.8 43.62,43.47 44.2,44.22 52.32,44.22 v52.38,43.92 | v52.2,39.44 52.22,39.19 53.57,37.84 U11.41
  Bottom 0.305: v52.38,43.92 52.38,39.72 v52.2,39.44
SW1
  Top 0.305: U10.4 60.06,24.27 U11.22
SW2
  Top 0.305: U10.5 58.93,23.62 58.37,24.18 U11.21
U1RX  (via drill 0.6)
  Top 0.305: J2.3 94.06,32.81 90.98,32.84 83.57,32.84 v82.88,32.87 | v82.88,40.82 59.05,40.82 v58.14,41.68 | v57.58,34.95 57.58,36.62 U11.36
  Bottom 0.305: v82.88,32.87 v82.88,40.82 | v58.14,41.68 58.14,35.51 v57.58,34.95
U1TX  (via drill 0.6)
  Top 0.305: J2.2 81.89,30.27 v82.3,30.22 | U11.24 60.85,27.66 59.72,27.66 v59.08,27.02 | v61.8,15.72 82.3,15.72 v82.32,15.82
  Bottom 0.305: v82.3,30.22 v82.32,15.82 | v61.8,15.72 61.8,25.78 v59.08,27.02
U2RX  (via drill 0.6)
  Top 0.305: U11.32 62.28,34.11 62.69,34.52 v62.69,35.86 | v66.17,19.02 90.35,19.05 91.34,20.29 J3.3
  Bottom 0.305: v62.69,35.86 62.74,32.69 66.19,27.89 v66.17,19.02
U2TX  (via drill 0.6)
  Top 0.305: v55.88,15.75 58.37,15.75 59.49,14.63 89.97,14.63 92.18,17.75 J3.2 | U11.27 59.94,30.12 59.49,29.51 56.62,29.51 v56.62,29.54
  Bottom 0.305: v56.62,29.54 56.62,24.1 55.88,23.37 v55.88,15.75
VBUS  (via drill 0.6)
  Top 0.305: U11.42 52.78,35.33 v52.76,34.97 | v52.78,9.85 59.85,9.85 J5.VBUS
  Top 0.61: J5.VBUS 66.02,8.02 C23.2
  Bottom 0.305: v52.76,34.97 v52.78,9.85
VCC  (via drill 0.6)
  Top 0.305: U6.8 U6.7 U6.6 | U3.8 U3.7 U3.6 94.82,55 C35.1 | U10.19 73.06,25.56 73.46,25.96 73.46,28.2 C30.1
  Top 0.406: U6.8 9.32,57.66 C34.1 | C35.1 95.64,56.36 v95.66,56.34 | v90.42,34.95 81.76,34.95 80.54,33.73 80.54,32.26 78.74,30.45 76.05,30.45 v76,30.5
  Top 0.61: J1.2 18,58.82 16.13,56.95 10.04,56.95 C34.1 | v31.9,33.32 34.9,32.71 34.9,31.16 35.79,30.27 JP1.2 37.13,30.27 39.65,27.76 v42.32,27.76 | v42.32,12.16 63.37,12.16 64.41,13.21 65.5,13.21 R5.2 75.1,13.22 v76,13.26 | v76,30.5 76,28.56 R6.2 75.98,28.34 C30.1
  Bottom 0.406: v90.42,34.95 90.35,35.02 90.35,50.49 92.48,52.63 93.83,52.63 95.66,54.46 v95.66,56.34 95.61,56.39 92.13,56.39 91.16,57.35 91.16,59.31 88.09,62.38 84.58,62.38 84.02,61.82 84.02,58.09 82,56.06 J7.2
  Bottom 0.61: v31.9,33.32 29.23,33.32 27.66,35.58 27.66,43.81 25.68,47.42 25.68,55.98 24.79,56.87 20.23,56.87 18,59.1 J1.2 | v42.32,27.76 v42.32,12.16 | v76,13.26 v76,30.5

### Text on the board
tPlace: TWO MOTOR CONTROLLER REV 2.0 | + | + | + | VIN | + | - | + | + | + | U10
tSilk: I2C | UART 1 | UART 2 | SW1 | SENSE1 | SW2 | SENSE2